# EAGLE design VenusGPS (EAGLE 6.1)
DATABASE: ./../PARTSDB.TXT
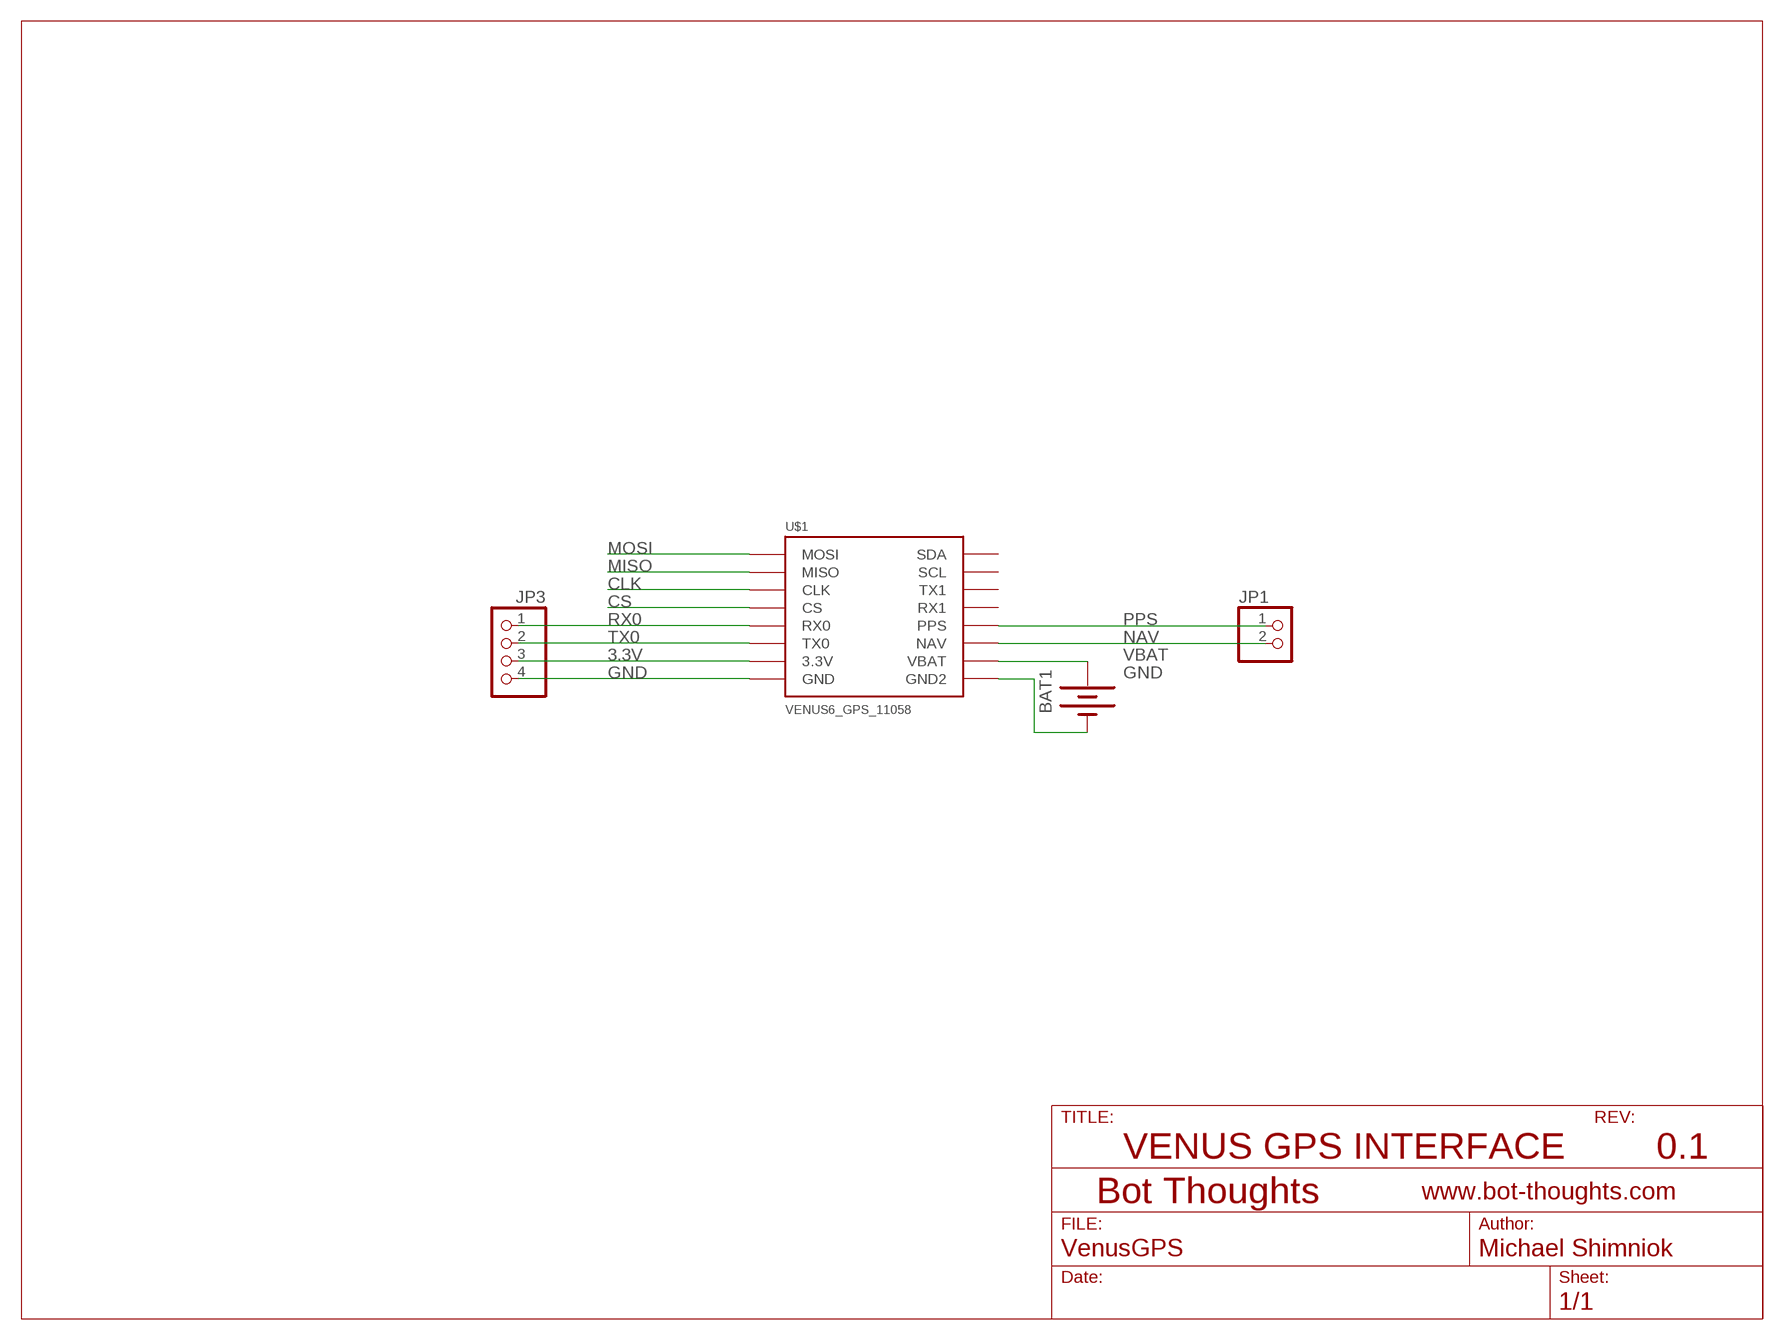
[diagram p0: schematic, sheet 1]

## Parts
BAT1  BATTERY12MM  [BATTCON_12MM]
JP1  PINHD-1X02_2.54  [1X02]
JP3  PINHD-1X04_2.54  [1X04]
U$1  VENUS6_GPS_11058  [VENUS6]

## Nets
3.3V: JP3.3 U$1.P7(3.3V)
CLK: U$1.P3(CLK)
CS: U$1.P4(CS)
GND: BAT1.GND(-) JP3.4 U$1.P8(GND) U$1.P9(GND2)
MISO: U$1.P2(MISO)
MOSI: U$1.P1(MOSI)
NAV: JP1.2 U$1.P11(NAV)
PPS: JP1.1 U$1.P12(PPS)
RX0: JP3.1 U$1.P5(RX0)
TX0: JP3.2 U$1.P6(TX0)
VBAT: BAT1.PWR@1(+) U$1.P10(VBAT)
Unconnected: U$1.P13(RX1) U$1.P14(TX1) U$1.P15(SCL) U$1.P16(SDA)

## Notes on the sheet
- VENUS GPS INTERFACE | 0.1

## Library data of the parts
BAT1 = SparkFun:BATTERY: Battery Holders Various common sizes : AA, AAA, 20mm coin cell and 12mm coin cell.; BOM: INCLUDE; PARTNO: 3000
JP1 = pinhead-2:PINHD-1X02: PIN HEADER; BOM: EXCLUDE
JP3 = pinhead-2:PINHD-1X04: PIN HEADER; BOM: EXCLUDE
U$1 = mes:VENUS6_GPS_11058: Venus GPS with SMA Connector Sparkfun sku: GPS-11058 <http://www.sparkfun.com/products/11058> Latest version of our Venus GPS board; the smallest, most powerful, and most versatile GPS receiver we carry. It's based on the Venus638FLPx, the successor to the Venus634LPx. The Venus638FLPx outputs standard NMEA-0183 or SkyTraq Binary sentences at a default rate of 9600bps (adjustable to 115200bps), with update rates up to 20Hz! The Venus638FLPx also allows for limited on-chip logging (check out the firmware below), as well as external logging using a SPI flash memory chip (not included).; BOM: EXCLUDE

## Board
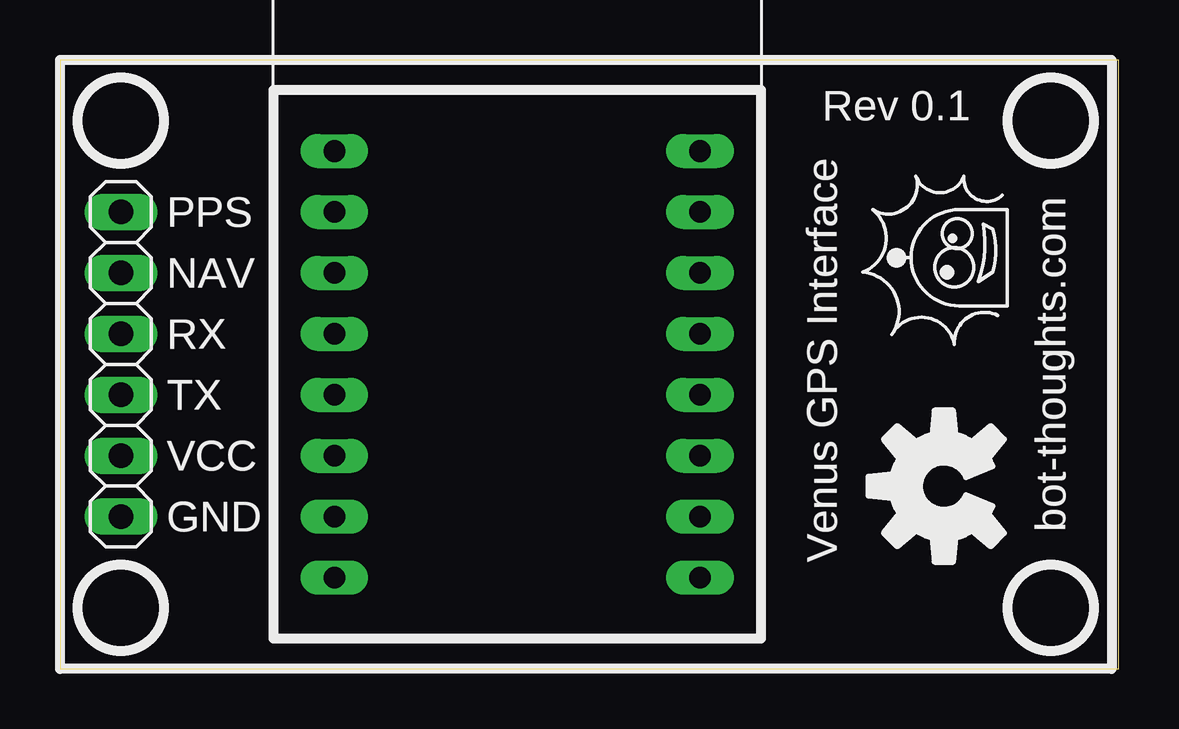
[diagram p1: board, top side]
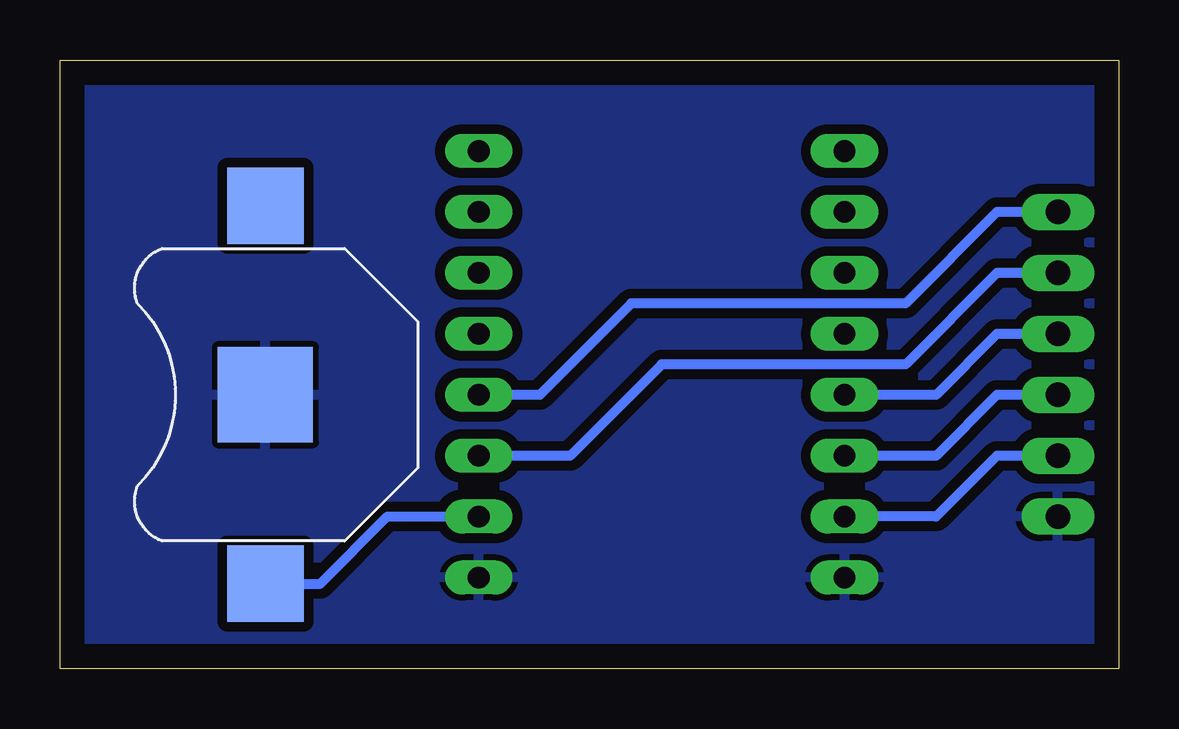
[diagram p2: board, bottom side, seen from below]

Size 44.12 x 25.39 mm. Coordinates in mm from the lower left corner, seen from the top.
Outline: 0,0 44.12,0 44.12,25.39 0,25.39 0,0
Copper layers (1*16): Top 0.035mm / dielectric 1.5mm / Bottom 0.035mm
Design rules: minimum track width 10mil, minimum drill 24mil, track to track 8mil, track to pad 8mil, pad to pad 8mil, via to via 8mil, smd to smd 8mil, copper to edge 40mil, drill to drill 8mil, minimum pad ring 10mil, minimum via ring 8mil, stop-mask expansion 4mil, vias tented up to drill 0mil, thermal gap 10mil

### Footprints (pad centres in the part's own frame; a part is rotated, then mirrored left to right if it is on the bottom)
BATTCON_12MM = smd 3.962 x 3.962: GND 0,0 | smd 3.175 x 3.175: PWR@1 -7.874,0; PWR@2 7.874,0
1X02 = drill 1.016 long: 1 -1.27,0; 2 1.27,0
1X04 = drill 1.016 long: 1 -3.81,0; 2 -1.27,0; 3 1.27,0; 4 3.81,0
VENUS6 = drill 0.9 long: P1 -7.62,8.89; P2 -7.62,6.35; P3 -7.62,3.81; P4 -7.62,1.27; P5 -7.62,-1.27; P6 -7.62,-3.81; P7 -7.62,-6.35; P8 -7.62,-8.89; P9 7.62,-8.89; P10 7.62,-6.35; P11 7.62,-3.81; P12 7.62,-1.27; P13 7.62,1.27; P14 7.62,3.81; P15 7.62,6.35; P16 7.62,8.89

### Placement (x,y rotation side)
BAT1  35.56,11.43 90 bottom
JP1  2.54,17.78 270 top
JP3  2.54,10.16 270 top
U$1  19.05,12.7 0 top

### Tracks (layer width: path | path; a pad name or v marks a point on that pad's centre or on a via)
3.3V
  Bottom 0.406: JP3.3 5.08,8.89 7.62,6.35 U$1.P7
GND
  pour Bottom (isolate 0.406, rank 2): 0,25.4 44.45,25.4 44.45,0 0,0
NAV
  Bottom 0.406: JP1.2 5.08,16.51 8.89,12.7 19.05,12.7 22.86,8.89 U$1.P11
PPS
  Bottom 0.406: JP1.1 5.08,19.05 8.89,15.24 20.32,15.24 24.13,11.43 U$1.P12
RX0
  Bottom 0.406: JP3.1 5.08,13.97 7.62,11.43 U$1.P5
TX0
  Bottom 0.406: JP3.2 5.08,11.43 7.62,8.89 U$1.P6
VBAT
  Bottom 0.406: BAT1.PWR@1 33.27,3.56 30.48,6.35 U$1.P10

### Text on the board
tNames: Rev 0.1 | PPS | NAV | RX | TX | VCC | GND | bot-thoughts.com | Venus GPS Interface
_tsilk: Rev 0.1 | PPS | NAV | RX | TX | VCC | GND | bot-thoughts.com | Venus GPS Interface